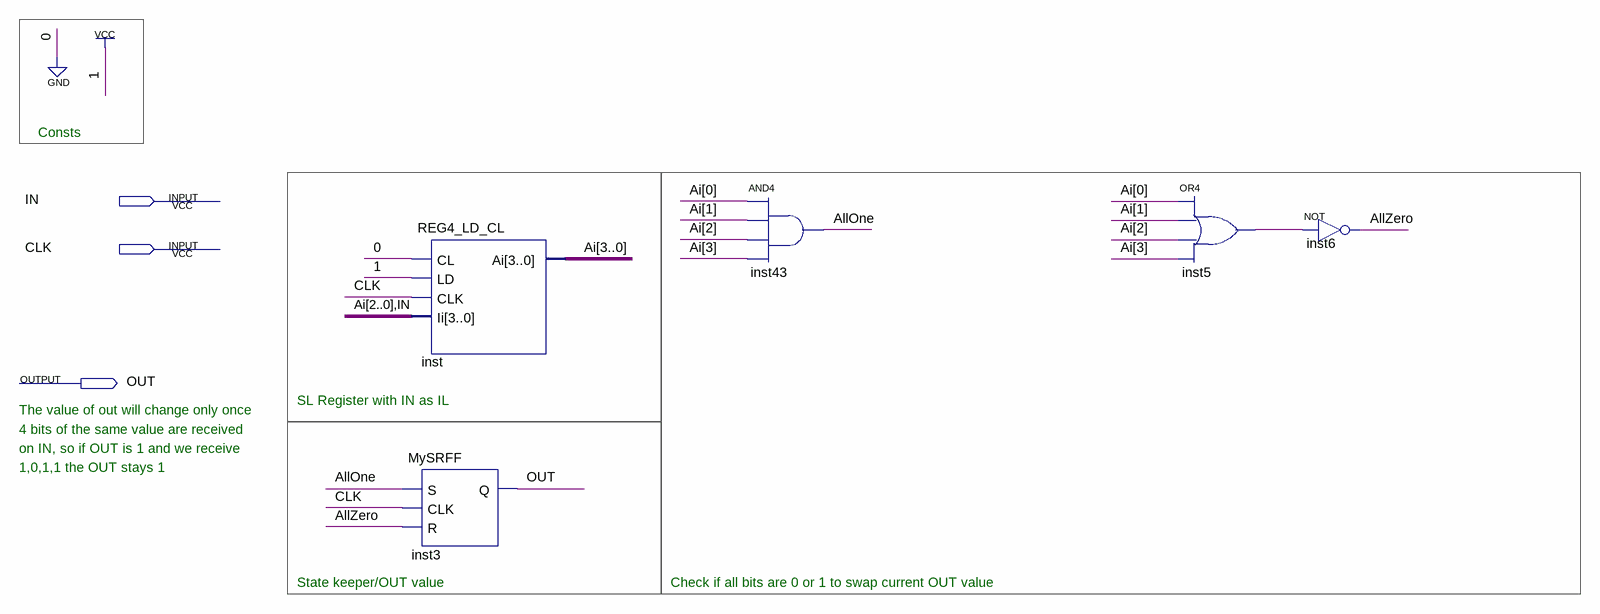
[diagram p0: schematic sheet]
// Quartus schematic DebouncerShort.bdf as structural Verilog: 5 symbols, 3 pins
module DebouncerShort (
  input  IN,
  input  CLK,
  output OUT
);

  wire AllOne, AllZero, inst5_out;
  wire [3:0] Ai;

  REG4_LD_CL inst (.CL(1'b0), .LD(1'b1), .CLK(CLK), .Ii({Ai[2:0], IN}), .Ai(Ai));
  MySRFF inst3 (.S(AllOne), .CLK(CLK), .R(AllZero), .Q(OUT));
  and inst43 (AllOne, Ai[0], Ai[1], Ai[2], Ai[3]);
  or inst5 (inst5_out, Ai[0], Ai[1], Ai[2], Ai[3]);
  not inst6 (AllZero, inst5_out);

  // Notes on the sheet:
  //   Consts
  //   SL Register with IN as IL
  //   The value of out will change only once
  //   4 bits of the same value are received
  //   on IN, so if OUT is 1 and we receive
  //   1,0,1,1 the OUT stays 1
  //   State keeper/OUT value
  //   Check if all bits are 0 or 1 to swap current OUT value
endmodule
